# EAGLE schematic numi_clock (EAGLE 7.4.0)
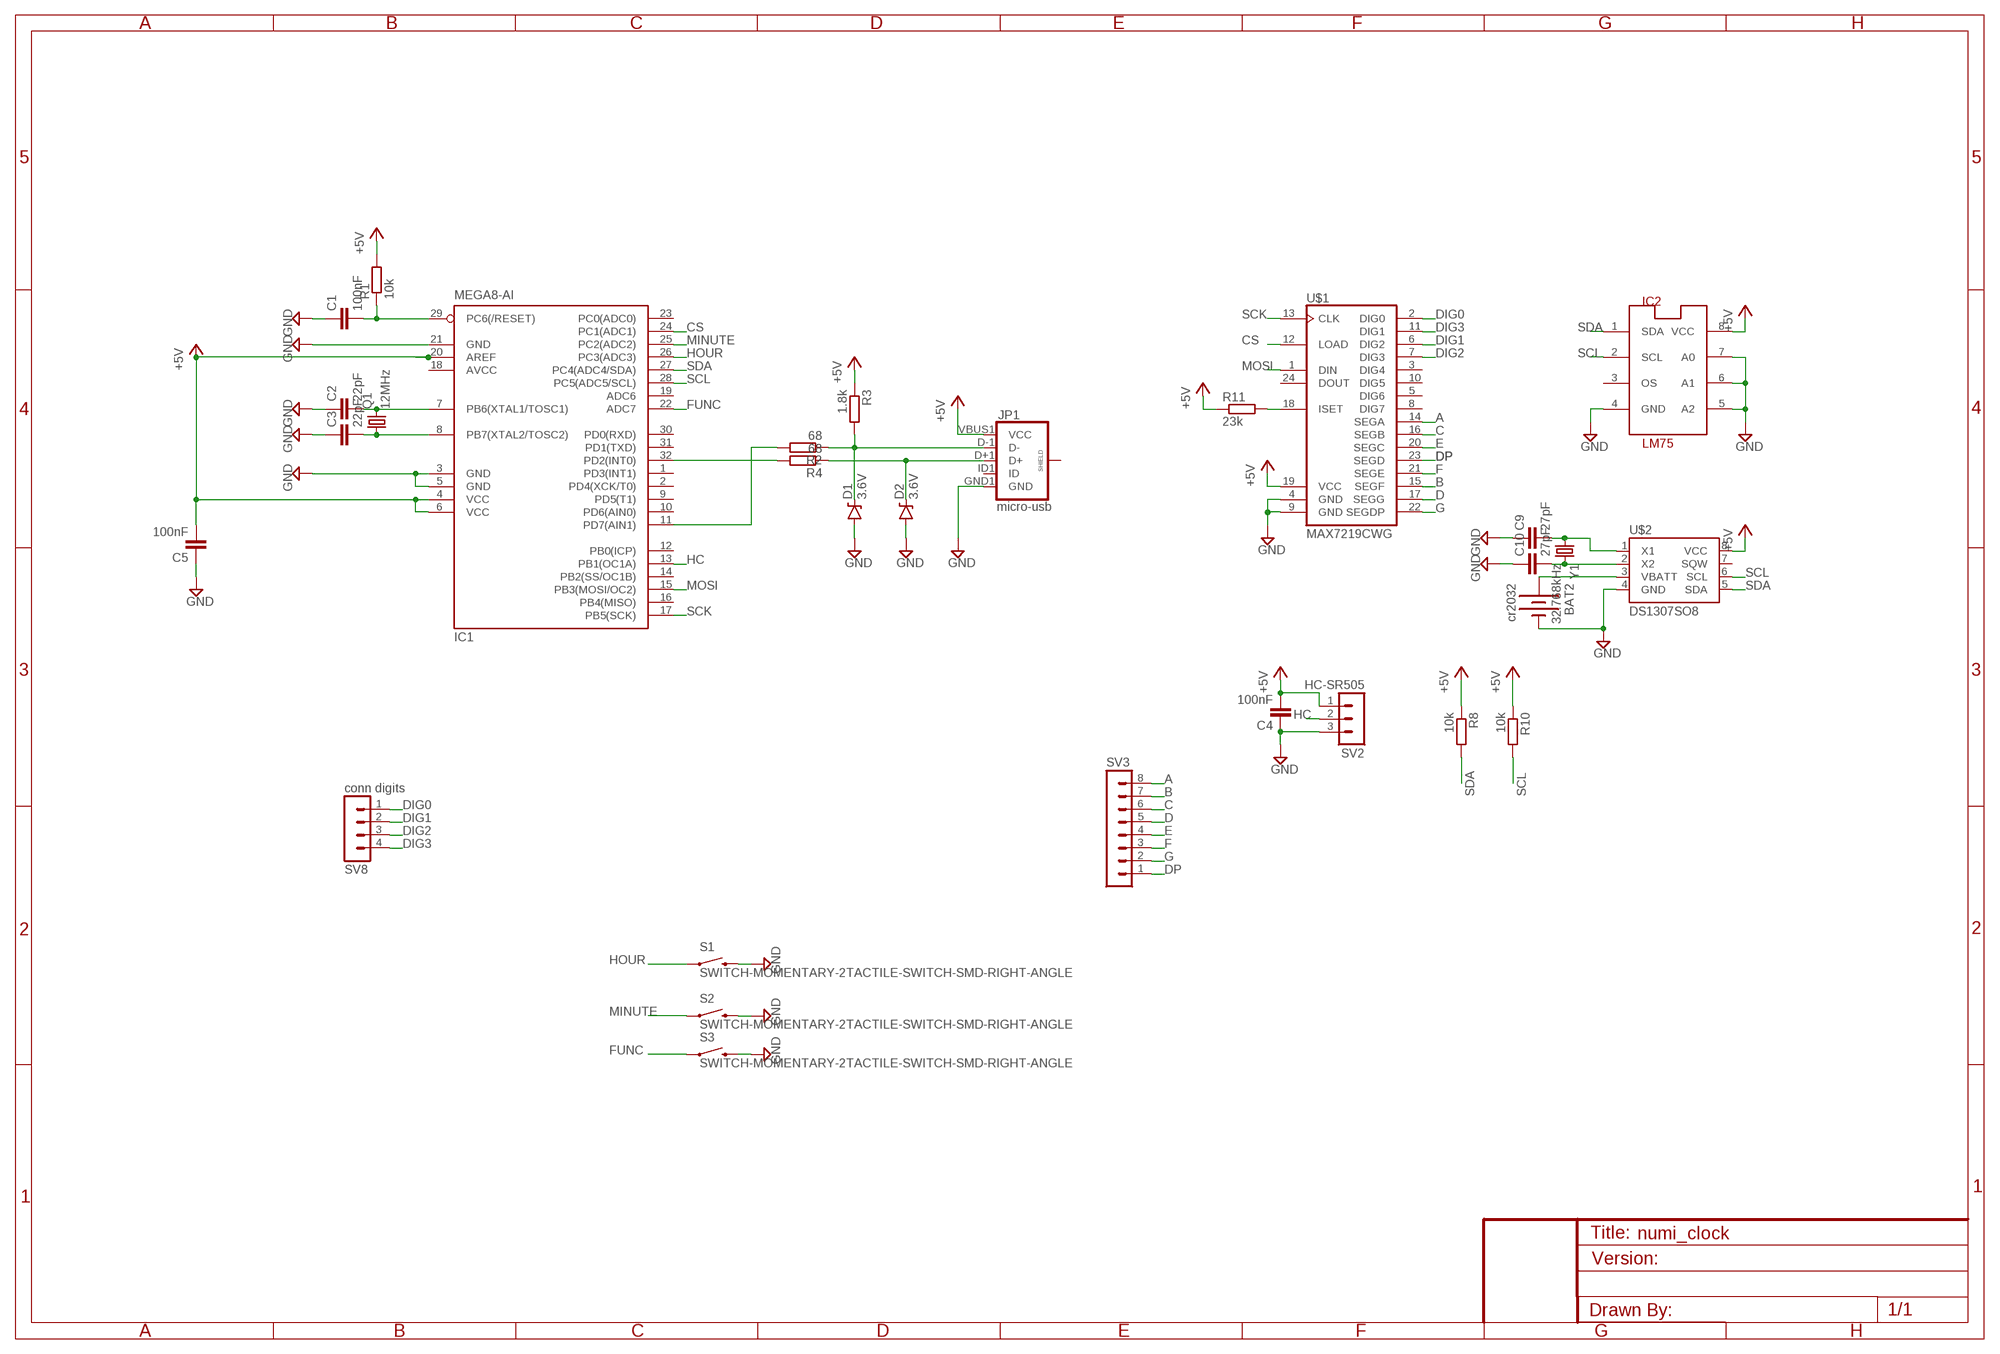
[diagram p0: schematic, sheet 1]

## Parts
BAT2  cr2032  BATTERY20PTH  [BATTCOM_20MM_PTH]
C1  100nF  C-EUC0805  [C0805]
C2  22pF  C-EUC0805  [C0805]
C3  22pF  C-EUC0805  [C0805]
C4  100nF  C-EUC0805  [C0805]
C5  100nF  C-EUC0805  [C0805]
C9  27pF  C-EUC0805  [C0805]
C10  27pF  C-EUC0805  [C0805]
D1  3.6V  DIODE-ZENER3.3V  [SOD-323]
D2  3.6V  DIODE-ZENER3.3V  [SOD-323]
IC1  MEGA8-AI  [TQFP32-08]
IC2  LM75  LM75_ICN  [SO8_LM75]
JP1  micro-usb  USB_MICROB_PLUGCONN-11752  [USB-B-MICRO-SMD_V03]
Q1  12MHz  CRYSTALCTS406  [CTS406]
R1  10k  R-EU_R0805  [R0805]
R2  68  R-EU_R0805  [R0805]
R3  1.8k  R-EU_R0805  [R0805]
R4  68  R-EU_R0805  [R0805]
R8  10k  R-EU_R0805  [R0805]
R10  10k  R-EU_R0805  [R0805]
R11  23k  R-EU_R0805  [R0805]
S1  SWITCH-MOMENTARY-2TACTILE-SWITCH-SMD-RIGHT-ANGLE  [TACTILE_SWITCH-SMD-RIGHT-ANGLE]
S2  SWITCH-MOMENTARY-2TACTILE-SWITCH-SMD-RIGHT-ANGLE  [TACTILE_SWITCH-SMD-RIGHT-ANGLE]
S3  SWITCH-MOMENTARY-2TACTILE-SWITCH-SMD-RIGHT-ANGLE  [TACTILE_SWITCH-SMD-RIGHT-ANGLE]
SV2  HC-SR505  MA03-1  [MA03-1]
SV3  MA08-1  [MA08-1]
SV8  conn digits  MA04-1  [MA04-1]
U$1  MAX7219CWG  [SO24L]
U$2  DS1307SO8  [SO08]
Y1  32.768kHz  CRYSTALTC26H  [TC26H]

## Nets
+5V: C4.2 C5.2 IC1.4(VCC) IC1.6(VCC) IC1.20(AREF) IC2.8(VCC) JP1.VBUS1(VCC) R1.2 R3.1 R8.1 R10.1 R11.1 SV2.1 U$1.19(VCC) U$2.8(VCC)
A: SV3.8 U$1.14(SEGA)
B: SV3.7 U$1.15(SEGF)
C: SV3.6 U$1.16(SEGB)
CS: IC1.24(PC1(ADC1)) U$1.12(LOAD)
D: SV3.5 U$1.17(SEGG)
DIG0: SV8.1 U$1.2(DIG0)
DIG1: SV8.2 U$1.6(DIG2)
DIG2: SV8.3 U$1.7(DIG3)
DIG3: SV8.4 U$1.11(DIG1)
DP: SV3.1 U$1.23(SEGD)
E: SV3.4 U$1.20(SEGC)
F: SV3.3 U$1.21(SEGE)
FUNC: IC1.22(ADC7) S3.1
G: SV3.2 U$1.22(SEGDP)
GND: BAT2.2(-) C1.1 C2.1 C3.1 C4.1 C5.1 C9.1 C10.1 D1.A D2.A IC1.3(GND) IC1.5(GND) IC1.21(GND) IC2.4(GND) IC2.5(A2) IC2.6(A1) IC2.7(A0) JP1.GND1(GND) S1.2 S2.2 S3.2 SV2.3 U$1.4(GND) U$1.9(GND) U$2.4(GND)
HC: IC1.13(PB1(OC1A)) SV2.2
HOUR: IC1.26(PC3(ADC3)) S1.1
MINUTE: IC1.25(PC2(ADC2)) S2.1
MOSI: IC1.15(PB3(MOSI/OC2)) U$1.1(DIN)
N$1: C2.2 IC1.7(PB6(XTAL1/TOSC1)) Q1.3
N$2: C3.2 IC1.8(PB7(XTAL2/TOSC2)) Q1.1
N$3: R11.2 U$1.18(ISET)
N$4: C9.2 U$2.1(X1) Y1.1
N$5: C10.2 U$2.2(X2) Y1.2
N$6: BAT2.1(+) U$2.3(VBATT)
N$7: D2.C JP1.D+1(D+) R4.1
N$8: D1.C JP1.D-1(D-) R2.1 R3.2
N$9: IC1.32(PD2(INT0)) R4.2
N$10: IC1.11(PD7(AIN1)) R2.2
RESET: C1.2 IC1.29(PC6(/RESET)) R1.1
SCK: IC1.17(PB5(SCK)) U$1.13(CLK)
SCL: IC1.28(PC5(ADC5/SCL)) IC2.2(SCL) R10.2 U$2.6(SCL)
SDA: IC1.27(PC4(ADC4/SDA)) IC2.1(SDA) R8.2 U$2.5(SDA)
Unconnected: IC1.1(PD3(INT1)) IC1.2(PD4(XCK/T0)) IC1.9(PD5(T1)) IC1.10(PD6(AIN0)) IC1.12(PB0(ICP)) IC1.14(PB2(SS/OC1B)) IC1.16(PB4(MISO)) IC1.19(ADC6) IC1.23(PC0(ADC0)) IC1.30(PD0(RXD)) IC1.31(PD1(TXD)) IC2.3(OS) JP1.ID1(ID) JP1.SHIELD1(SHIELD) JP1.SHIELD2(SHIELD) JP1.SHIELD3(SHIELD) U$1.3(DIG4) U$1.5(DIG6) U$1.8(DIG7) U$1.10(DIG5) U$1.24(DOUT) U$2.7(SQW)

## Power pins joined to a net without a drawn wire
AVCC: IC1.18(AVCC)

## Library data of the parts
BAT2 = SparkFun:BATTERY: Battery Holders Various common sizes : AA, AAA, 20mm coin cell and 12mm coin cell.
C1-C5 C9 C10 = rcl:C-EU: CAPACITOR, European symbol
D1 D2 = SparkFun-DiscreteSemi:DIODE-ZENER: Zener Diode Production Part - 8199 3.4V Zener Voltage; PROD_ID: DIO-11284; VALUE: 3.3V
IC1 = atmel:MEGA8: MICROCONTROLLER 8 Kbytes FLASH, 1 kbytes SRAM, 512 bytes EEPROM, USART, 6-channel 10 bit ADC, 2-channel 8 bit ADC Pin compatible with Atmega48, ATMega88, ATMega168 Source: avr.lbr; MPN: ATMEGA8-16AU; OC_FARNELL: 9171371; OC_NEWARK: 73M8863
IC2 = lm75:LM75_IC: Temperatursensor
JP1 = SparkFun-Connectors:USB_MICROB_PLUG: USB Micro-B connectors Some male, some female. Watch your step!; PROD_ID: CONN-11752
Q1 = crystal:CRYSTAL: CRYSTAL; OC_FARNELL: unknown; OC_NEWARK: unknown
R1-R4 R8 R10 R11 = rcl:R-EU_: RESISTOR, European symbol
S1-S3 = SparkFun-Electromechanical:SWITCH-MOMENTARY-2: Various NO switches- pushbuttons, reed, etc; PROD_ID: COMP-12265
SV2 = con-lstb:MA03-1: PIN HEADER; OC_FARNELL: unknown; OC_NEWARK: unknown
SV3 = con-lstb:MA08-1: PIN HEADER; OC_FARNELL: unknown; OC_NEWARK: unknown
SV8 = con-lstb:MA04-1: PIN HEADER; OC_FARNELL: unknown; OC_NEWARK: unknown
U$1 = max7219:MAX7219CWG
U$2 = SparkFun-FreqCtrl:DS1307: I2C real-time clock with battery backup.
Y1 = SparkFun-FreqCtrl:CRYSTAL: Various standard crystals. Proven footprints.; PROD_ID: XTAL-10112